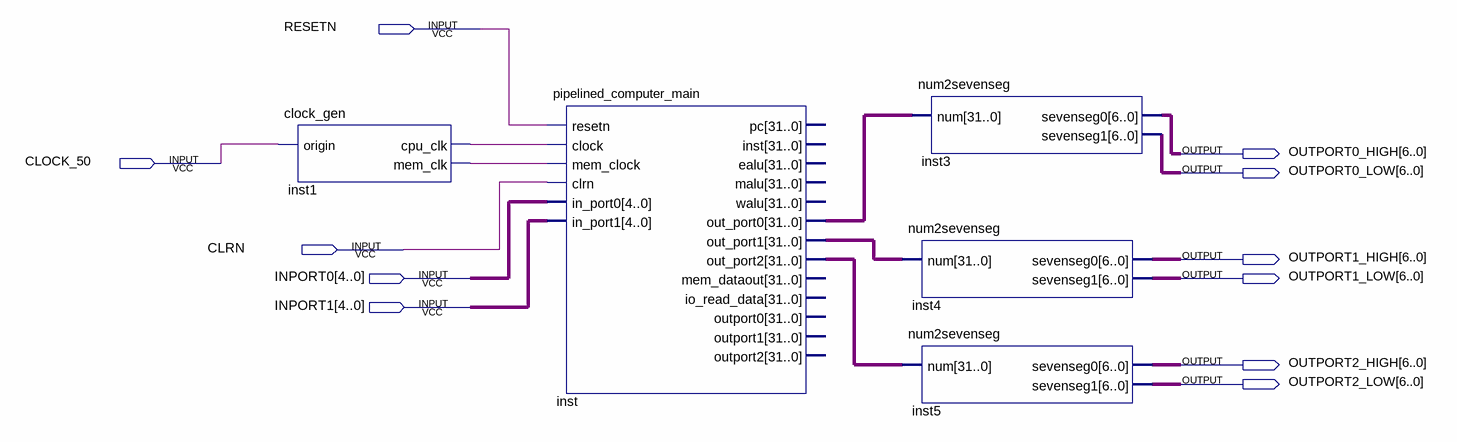
[diagram p0: schematic sheet]
// Quartus schematic pipelined_computer.bdf as structural Verilog: 5 symbols, 11 pins
module pipelined_computer (
  input  RESETN,
  input  CLOCK_50,
  input  CLRN,
  input  [4:0] INPORT0,
  input  [4:0] INPORT1,
  output [6:0] OUTPORT0_HIGH,
  output [6:0] OUTPORT0_LOW,
  output [6:0] OUTPORT1_HIGH,
  output [6:0] OUTPORT1_LOW,
  output [6:0] OUTPORT2_HIGH,
  output [6:0] OUTPORT2_LOW
);

  wire inst1_cpu_clk, inst1_mem_clk;
  wire [31:0] inst_out_port0, inst_out_port1, inst_out_port2;

  clock_gen inst1 (.origin(CLOCK_50), .cpu_clk(inst1_cpu_clk), .mem_clk(inst1_mem_clk));
  pipelined_computer_main inst (
    .resetn(RESETN), .clock(inst1_cpu_clk), .mem_clock(inst1_mem_clk), .clrn(CLRN), .in_port0(INPORT0),
    .in_port1(INPORT1), .out_port0(inst_out_port0), .out_port1(inst_out_port1), .out_port2(inst_out_port2));  // open: pc, inst, ealu, malu, walu, mem_dataout, io_read_data, outport0, outport1, outport2
  num2sevenseg inst3 (.num(inst_out_port0), .sevenseg0(OUTPORT0_HIGH), .sevenseg1(OUTPORT0_LOW));
  num2sevenseg inst4 (.num(inst_out_port1), .sevenseg0(OUTPORT1_HIGH), .sevenseg1(OUTPORT1_LOW));
  num2sevenseg inst5 (.num(inst_out_port2), .sevenseg0(OUTPORT2_HIGH), .sevenseg1(OUTPORT2_LOW));
endmodule
